# Altium schematic sheet EXTERN.SchDoc
size A4
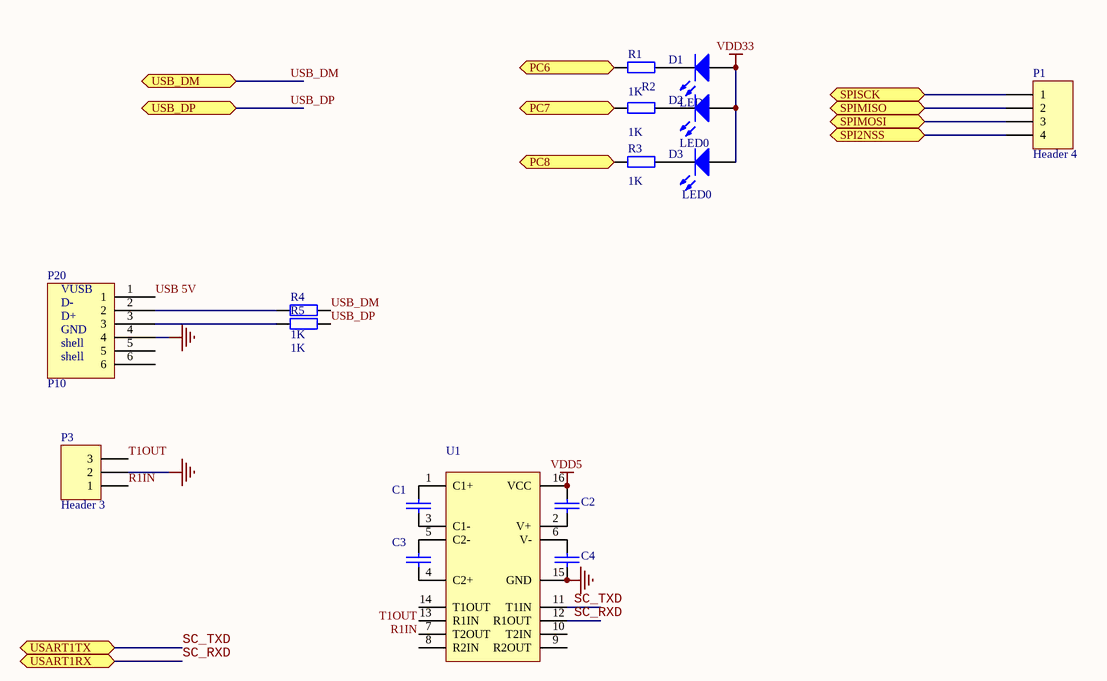
[diagram p0: EXTERN.SchDoc]

## Parts
C1  0.1uF  [0805]  (value not drawn)
C2  0.1uF  [0805]  (value not drawn)
C3  0.1uF  [0805]  (value not drawn)
C4  0.1uF  [0805]  (value not drawn)
D1  LED0  [0805]
D2  LED0  [0805]
D3  LED0  [0805]
P1  Header 4  [HDR1X4]
P3  Header 3  [HDR1X3]
P20  P10  [787616]
R1  value 1K  [0805]  (hidden comment: Res2)
R2  value 1K  [0805]  (hidden comment: Res2)
R3  value 1K  [0805]  (hidden comment: Res2)
R4  value 1K  [0805]  (hidden comment: Res2)
R5  value 1K  [0805]  (hidden comment: Res2)
U1  MAX232-2  [SOIC16]  (value not drawn)

## Ports
PC6 (bidir), PC7 (bidir), PC8 (bidir), SPI2NSS (bidir), SPIMISO (bidir), SPIMOSI (bidir), SPISCK (bidir), USART1RX (bidir), USART1TX (bidir), USB_DM (bidir), USB_DP (bidir)

## Nets
GND: C4.2 P3.2 P20.4 U1.15(GND)
VDD5: C2.1 U1.16(VCC)
VDD33: D1.1(A) D2.1(A) D3.1(A)
PC6: R1.1 ; port PC6
PC7: R2.1 ; port PC7
PC8: R3.1 ; port PC8
R1IN: P3.1 U1.13(R1IN)
SC_RXD: U1.12(R1OUT) ; port USART1RX
SC_TXD: U1.11(T1IN) ; port USART1TX
SPI2NSS: P1.4 ; port SPI2NSS
SPIMISO: P1.2 ; port SPIMISO
SPIMOSI: P1.3 ; port SPIMOSI
SPISCK: P1.1 ; port SPISCK
T1OUT: P3.3 U1.14(T1OUT)
USB 5V: P20.1
USB_DM: R4.2 ; port USB_DM
USB_DP: R5.2 ; port USB_DP
NetC1_1: C1.1 U1.1(C1+)
NetC1_2: C1.2 U1.3(C1-)
NetC2_2: C2.2 U1.2(V+)
NetC3_1: C3.1 U1.5(C2-)
NetC3_2: C3.2 U1.4(C2+)
NetC4_1: C4.1 U1.6(V-)
NetD1_2: D1.2(K) R1.2
NetD2_2: D2.2(K) R2.2
NetD3_2: D3.2(K) R3.2
NetP20_2: P20.2 R4.1
NetP20_3: P20.3 R5.1

Not connected (* = marked no-connect by the designer): P20 5 6; U1 7(T2OUT) 8(R2IN) 9(R2OUT) 10(T2IN)

## Notes on the sheet
- (in symbol COMPONENT_1) VUSB; D-; D+; GND; shell

## Library data of the parts
C1-C4 = CAP: Capacitor
D1-D3 = LED0: Typical INFRARED GaAs LED; Published: 8-Jun-2000; LatestRevisionDate: 08-Jul-2005; LatestRevisionNote: Mech Layer 1 removed.; PackageReference: LED-0; Publisher: Altium Limited
P1 = Header 4: Header, 4-Pin; LatestRevisionDate: 17-Jul-2002; LatestRevisionNote: Re-released for DXP Platform.; Publisher: Altium Limited
P3 = Header 3: Header, 3-Pin; LatestRevisionDate: 17-Jul-2002; LatestRevisionNote: Re-released for DXP Platform.; Publisher: Altium Limited
P20 = COMPONENT_1
R1-R5 = Res2: Resistor; Published: 8-Jun-2000; LatestRevisionDate: 17-Jul-2002; LatestRevisionNote: Re-released for DXP Platform.; PackageReference: AXIAL-0.4; Publisher: Altium Limited
U1 = MAX3232-2